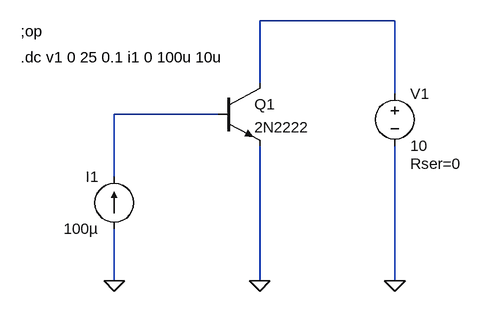
[diagram p0: schematic Draft2.asc]
Draft2.asc, the LTspice schematic file:
Version 4
SHEET 1 880 680
WIRE 192 -144 -16 -144
WIRE -16 -48 -16 -144
WIRE 192 -32 192 -144
WIRE -80 0 -240 0
WIRE -240 96 -240 0
WIRE -240 256 -240 176
WIRE -16 256 -16 48
WIRE 192 256 192 48
FLAG -240 256 0
FLAG -16 256 0
FLAG 192 256 0
SYMBOL voltage 192 -48 R0
WINDOW 123 0 0 Left 0
WINDOW 39 24 124 Left 2
SYMATTR InstName V1
SYMATTR Value 10
SYMATTR SpiceLine Rser=0
SYMBOL current -240 176 R180
WINDOW 0 24 80 Left 2
WINDOW 3 24 0 Left 2
WINDOW 123 0 0 Left 0
WINDOW 39 0 0 Left 0
SYMATTR InstName I1
SYMATTR Value 100µ
SYMBOL npn -80 -48 R0
SYMATTR InstName Q1
SYMATTR Value 2N2222
TEXT -384 -128 Left 2 !;op
TEXT -384 -88 Left 2 !.dc v1 0 25 0.1 i1 0 100u 10u

The netlist it stands for:
* Draft2.asc
V1 N001 0 10 Rser=0
I1 0 N002 100µ
Q1 N001 N002 0 0 2N2222
.model NPN NPN
.model PNP PNP
.lib standard.bjt
;op
.dc v1 0 25 0.1 i1 0 100u 10u
.backanno
.end